# EAGLE design Base Station 2.4 (EAGLE 9.0.0)
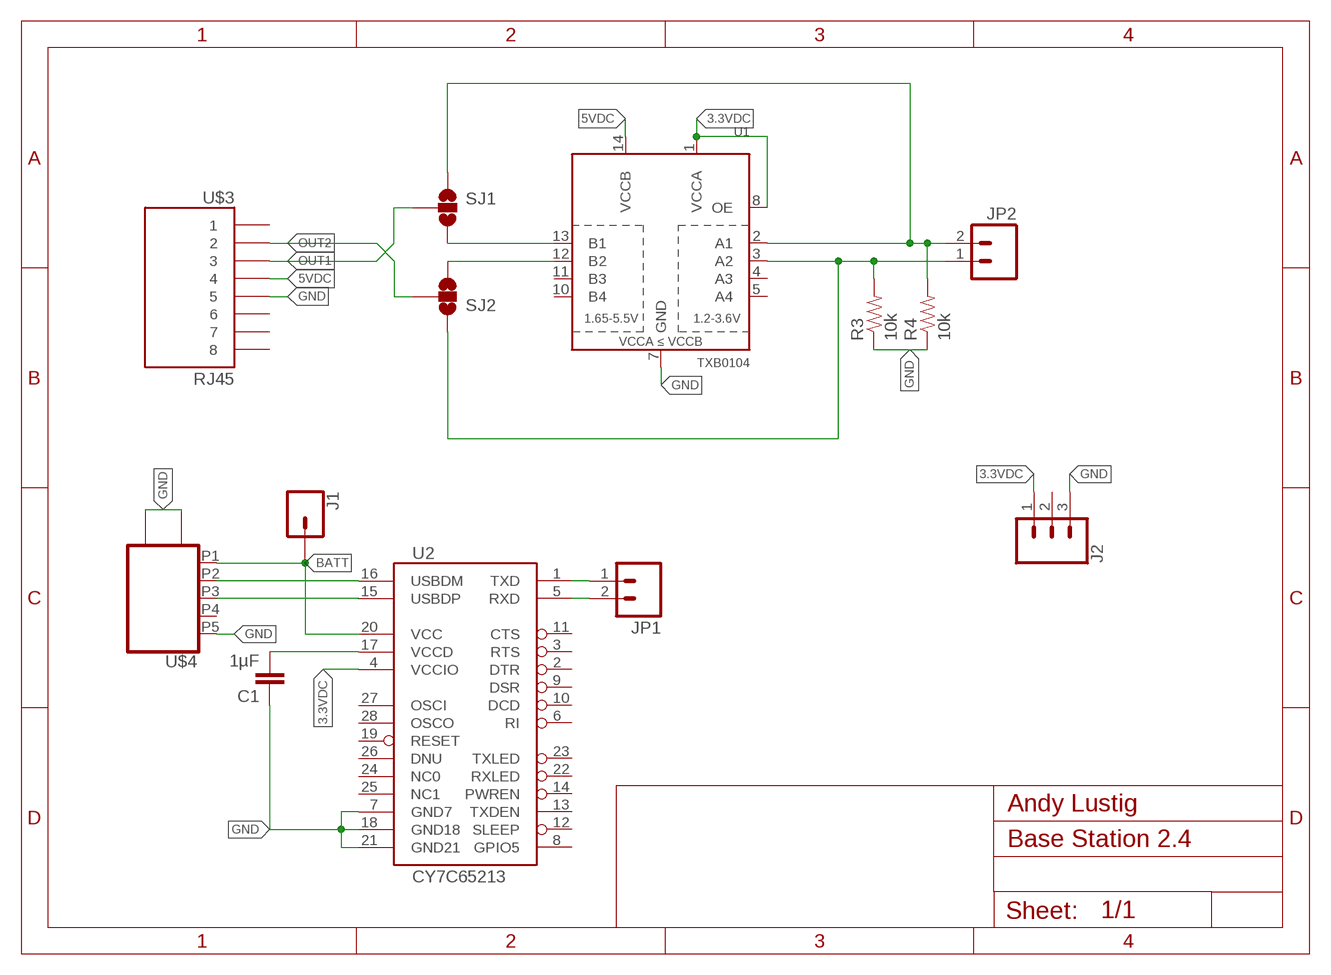
[diagram p0: schematic, sheet 1]

## Parts
C1  1µF  0.1UF-0603-25V-5%  [0603]
J1  CONN_01PTH_NO_SILK_YES_STOP  [1X01_NO_SILK]
J2  CONN_031X03_NO_SILK  [1X03_NO_SILK]
JP1  M021X02_NO_SILK  [1X02_NO_SILK]
JP2  M021X02_NO_SILK  [1X02_NO_SILK]
R3  10k  RESISTOR0805-RES  [0805]
R4  10k  RESISTOR0805-RES  [0805]
SJ1  SOLDERJUMPER_2WAYPASTE2&3  [SJ_3_PASTE2&3]
SJ2  SOLDERJUMPER_2WAYPASTE2&3  [SJ_3_PASTE2&3]
U1  TXB0104  TXB0104PWR  [TSSOP14]
U2  CY7C65213  [SSOP28DB]
U$3  RJ45  [RJ45-8]
U$4  USB_MICRO_SOCKET_HORZ_REINFORCED  [USB_HORZ_REINFORCED_MICRO]

## Nets
3.3VDC: J2.1 U1.1(VCCA) U1.8(OE) U2.4(VCCIO)
5VDC: U1.14(VCCB) U$3.4
BATT: J1.1 U2.20(VCC) U$4.P1
GND: C1.1 J2.3 R3.1 R4.1 U1.7(GND) U2.7(GND7) U2.18(GND18) U2.21(GND21) U$3.5 U$4.G1 U$4.G2 U$4.P5 U$4.P$1 U$4.P$2
N$1: JP1.1 U2.1(TXD)
N$2: JP1.2 U2.5(RXD)
N$3: U2.15(USBDP) U$4.P3
N$4: U2.16(USBDM) U$4.P2
N$5: C1.2 U2.17(VCCD)
N$6: JP2.2 R4.2 SJ1.1 U1.2(A1)
N$7: JP2.1 R3.2 SJ2.1 U1.3(A2)
N$8: SJ2.3 U1.12(B2)
N$9: SJ1.3 U1.13(B1)
OUT1: SJ1.2 U$3.3
OUT2: SJ2.2 U$3.2
Unconnected: J2.2 U1.4(A3) U1.5(A4) U1.10(B4) U1.11(B3) U2.2(DTR) U2.3(RTS) U2.6(RI) U2.8(GPIO5) U2.9(DSR) U2.10(DCD) U2.11(CTS) U2.12(SLEEP) U2.13(TXDEN) U2.14(PWREN) U2.19(RESET) U2.22(RXLED) U2.23(TXLED) U2.24(NC0) U2.26(DNU) U2.27(OSCI) U2.28(OSCO) U$3.1 U$3.6 U$3.7 U$3.8 U$4.P4

## Power pins joined to a net without a drawn wire
NC1: U2.25(NC1)

## Library data of the parts
C1 = SparkFun-Capacitors:0.1UF: 0.1µF ceramic capacitors A capacitor is a passive two-terminal electrical component used to store electrical energy temporarily in an electric field.; PROD_ID: CAP-08604; VALUE: 0.1uF
J1 = SparkFun-Connectors:CONN_01: Single connection point. Often used as Generic Header-pin footprint for 0.1 inch spaced/style header connections On any of the 0.1 inch spaced packages, you can populate with these: Break Away Headers - Straight <https://www.sparkfun.com/products/116> (PRT-00116) Break Away Male Headers - Right Angle <https://www.sparkfun.com/products/553> (PRT-00553) Female Headers <https://www.sparkfun.com/products/115> (PRT-00115) Break Away Headers - Machine Pin <https://www.sparkfun.com/products/117> (PRT-00117) Break Away Female Headers - Swiss Machine Pin <https://www.sparkfun.com/products/743> (PRT-00743) This device is also useful as a general connection point to wire up your design to another part of your project. Our various solder wires solder well into these plated through hole pads. Hook-Up Wire - Assortment (Stranded, 22 AWG) <https://www.sparkfun.com/products/11375> (PRT-11375) Hook-Up Wire - Assortment (Solid Core, 22 AWG) <https://www.sparkfun.com/products/11367> (PRT-11367) View the entire wire category on our website here <https://www.sparkfun.com/categories/141> Special notes: SMTSO-256-ET is a "flush mount" nut for a 4-40 screw. We mostly use this on specialty testbeds; it is a nice way to connect hardware to your PCB at an adjustable hieght. Also note, the SNAP packages are for using a snappable style connector. We sell a baggie of snaps and they are also used on two LilyPad designs: Snap Assortment - 30 pack (male and female) <https://www.sparkfun.com/products/11347> (DEV-11347) LilyPad Arduino SimpleSnap <https://www.sparkfun.com/products/10941> (DEV-10941) LilyPad SimpleSnap Protoboard <https://www.sparkfun.com/products/10940> (DEV-10940)
J2 = SparkFun-Connectors:CONN_03: Multi connection point. Often used as Generic Header-pin footprint for 0.1 inch spaced/style header connections On any of the 0.1 inch spaced packages, you can populate with these: Break Away Headers - Straight <https://www.sparkfun.com/products/116> (PRT-00116) Break Away Male Headers - Right Angle <https://www.sparkfun.com/products/553> (PRT-00553) Female Headers <https://www.sparkfun.com/products/115> (PRT-00115) Break Away Headers - Machine Pin <https://www.sparkfun.com/products/117> (PRT-00117) Break Away Female Headers - Swiss Machine Pin <https://www.sparkfun.com/products/743> (PRT-00743) Stackable Header - 3 Pin (Female, 0.1") <https://www.sparkfun.com/products/13875> (PRT-13875) For SCREWTERMINALS and SPRING TERMINALS visit here: Screw Terimnals on SparkFun.com <https://www.sparkfun.com/search/results?term=Screw+Terminals> (5mm/3.5mm/2.54mm spacing) This device is also useful as a general connection point to wire up your design to another part of your project. Our various solder wires solder well into these plated through hole pads. Hook-Up Wire - Assortment (Stranded, 22 AWG) <https://www.sparkfun.com/products/11375> (PRT-11375) Hook-Up Wire - Assortment (Solid Core, 22 AWG) <https://www.sparkfun.com/products/11367> (PRT-11367) View the entire wire category on our website here <https://www.sparkfun.com/categories/141> Special notes: Molex polarized connector foot print use with SKU : PRT-08232 with associated crimp pins and housings.
JP1 JP2 = SparkFun-Connectors:M02: Standard 2-pin 0.1" header. Use with - straight break away headers ( PRT-00116) - right angle break away headers (PRT-00553) - swiss pins (PRT-00743) - machine pins (PRT-00117) - female headers (PRT-00115) Molex polarized connector foot print use with: PRT-08233 with associated crimp pins and housings. 2.54_SCREWTERM for use with PRT-10571. 3.5mm Screw Terminal footprints for PRT-08084 5mm Screw Terminal footprints for use with PRT-08432
R3 R4 = Andy-library:RESISTOR: Resistor Basic schematic elements and footprints for 0603, 1206, and PTH resistors.
SJ1 SJ2 = SparkFun-Retired:SOLDERJUMPER_2WAY: Solder Jumper 2 way solder jumper
U1 = SparkFun-IC-Comms:TXB0104PWR: 4-Bit Bi-Directional Level Shifter 1.2V-3.6V (VCCA) to 1.65V-5.5V (VCCB) bi-directional level shifter with auto direction sensing. Max data rate - VCCA 1.8V: 20Mbps (50ns), VCCA 3.3V: 100Mbps (10ns) Digikey: 296-21929-1-ND (TSSOP) Datasheet <http://cdn.sparkfun.com/datasheets/BreakoutBoards/txb0104.pdf> SparkFun Products SparkFun Cellular Shield - MG2639 <https://www.sparkfun.com/products/13120> (CEL-13120) SparkFun Level Shifting microSD Breakout <https://www.sparkfun.com/products/13743> (DEV-13743) SparkFun Voltage-Level Translator Breakout - TXB0104 <https://www.sparkfun.com/products/11771> (BOB-11771) SparkFun Block for Intel® Edison - UART <https://www.sparkfun.com/products/13040> (DEV-13040) SparkFun Block for Intel® Edison - Arduino <https://www.sparkfun.com/products/13036> (DEV-13036); PROD_ID: NA-XXXXX
U2 = SparkFun-IC-Microcontroller:CY7C65213: CY7C65213 USB-UART controller USB UART SparkFun Products None; PROD_ID: IC-12487
U$3 = Andy-library:RJ45
U$4 = Andy-library:USB_MICRO_SOCKET: horizontal socket. Digikey 609-4616-1-ND

## Board
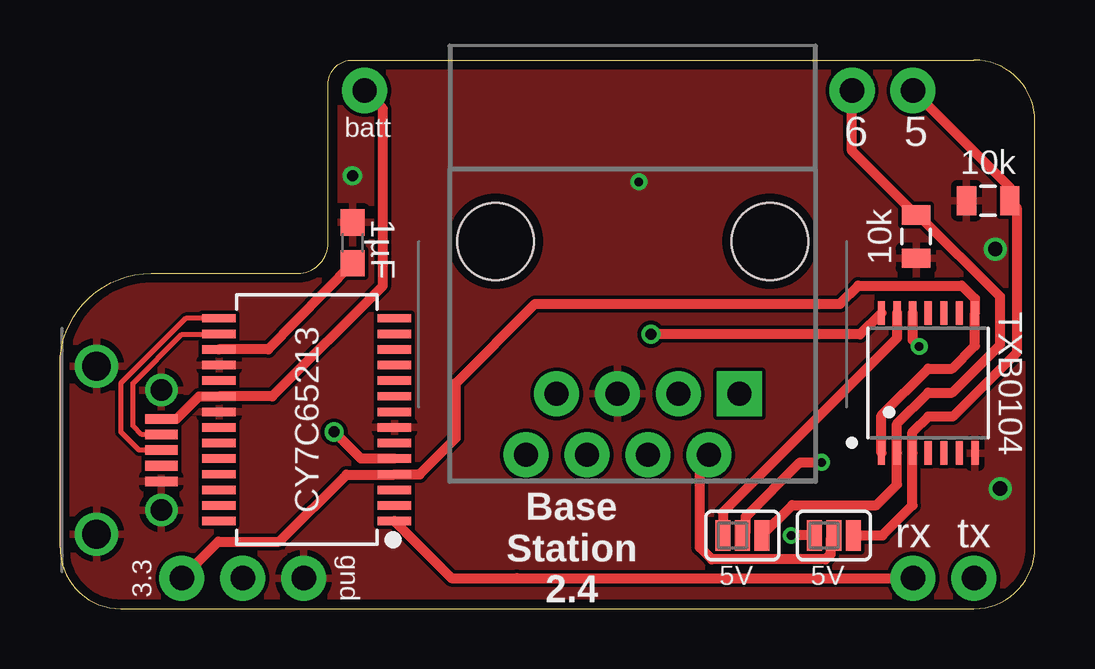
[diagram p1: board, top side]
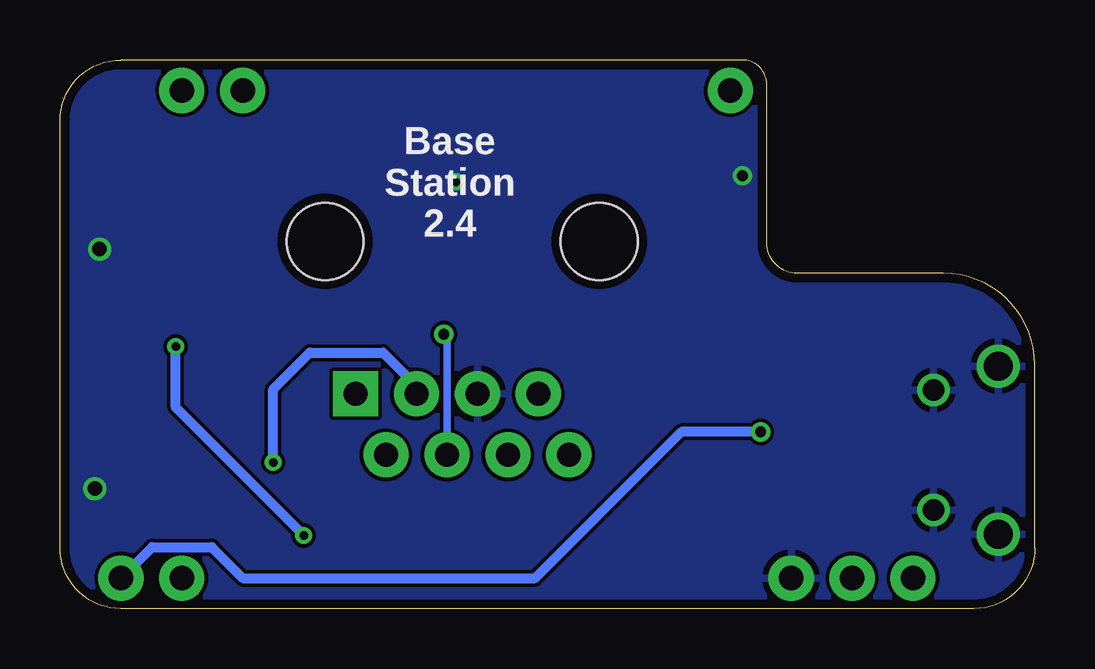
[diagram p2: board, bottom side, seen from below]

Size 40.64 x 22.86 mm. Coordinates in mm from the lower left corner, seen from the top.
Outline: 2.54,0 38.1,0 arc90 40.64,2.54 40.64,20.32 arc90 38.1,22.86 12.19,22.86 arc90 11.18,21.84 11.18,15.24 arc-90 9.91,13.97 3.81,13.97 arc90 0,10.16 0,2.54 arc90 2.54,0
Copper layers (1*16): Top 0.0356mm / dielectric 1.5011mm / Bottom 0.0356mm
Design rules "LaenPCBOrder *": minimum track width 6mil, minimum drill 13mil, track to track 6mil, track to pad 6mil, pad to pad 6mil, via to via 6mil, smd to smd 6mil, copper to edge 15mil, drill to drill 6mil, minimum pad ring 7mil, minimum via ring 7mil, stop-mask expansion 3mil, vias tented up to drill 25mil, thermal gap 10mil

### Footprints (pad centres in the part's own frame; a part is rotated, then mirrored left to right if it is on the bottom)
0603 = smd 1.1 x 1: 1 -0.85,0; 2 0.85,0
1X01_NO_SILK = drill 1.016 pad 1.88: 1 0,0
1X03_NO_SILK = drill 1.016 pad 1.88: 1 0,0; 2 2.54,0; 3 5.08,0
1X02_NO_SILK = drill 1.016 pad 1.88: 1 0,0; 2 2.54,0
0805 = smd 0.8 x 1.2: 1 -0.9,0; 2 0.9,0
SJ_3_PASTE2&3 = smd 0.635 x 1.27: 1 -0.813,0; 2 0,0; 3 0.813,0
TSSOP14 = smd 0.305 x 0.991: 1 -1.95,-2.918; 2 -1.3,-2.918; 3 -0.65,-2.918; 4 0,-2.918; 5 0.65,-2.918; 6 1.3,-2.918; 7 1.95,-2.918; 8 1.95,2.918; 9 1.3,2.918; 10 0.65,2.918; 11 0,2.918; 12 -0.65,2.918; 13 -1.3,2.918; 14 -1.95,2.918
SSOP28DB = smd 0.348 x 1.397: 1 -4.225,-3.656; 2 -3.575,-3.656; 3 -2.925,-3.656; 4 -2.275,-3.656; 5 -1.625,-3.656; 6 -0.975,-3.656; 7 -0.325,-3.656; 8 0.325,-3.656; 9 0.975,-3.656; 10 1.625,-3.656; 11 2.275,-3.656; 12 2.925,-3.656; 13 3.575,-3.656; 14 4.225,-3.656; 15 4.225,3.656; 16 3.575,3.656; 17 2.925,3.656; 18 2.275,3.656; 19 1.625,3.656; 20 0.975,3.656; 21 0.325,3.656; 22 -0.325,3.656; 23 -0.975,3.656; 24 -1.625,3.656; 25 -2.275,3.656; 26 -2.925,3.656; 27 -3.575,3.656; 28 -4.225,3.656
RJ45-8 = drill 1 pad 1.88 square: 1 -4.445,6.35 | drill 1 pad 1.88: 2 -3.175,8.89; 3 -1.905,6.35; 4 -0.635,8.89; 5 0.635,6.35; 6 1.905,8.89; 7 3.175,6.35; 8 4.445,8.89 | hole 3.2: -5.715,0; 5.715,0
USB_HORZ_REINFORCED_MICRO = drill 1.2: G1 -3.5,0; G2 3.5,0 | smd 0.4 x 1.35: P1 -1.3,2.7; P2 -0.65,2.7; P3 0,2.7; P4 0.65,2.7; P5 1.3,2.7 | drill 0.9: P$1 -2.5,2.7; P$2 2.5,2.7

### Placement (x,y rotation side)
C1  12.19,15.24 270 top
J1  12.7,21.59 0 top
J2  5.08,1.27 0 top
JP1  35.56,1.27 0 top
JP2  35.56,21.59 180 top
R3  38.69,17 0 top
R4  35.69,15.5 90 top
SJ1  28.45,3.05 180 top
SJ2  32.26,3.05 180 top
U1  36.19,9.4 0 top
U2  10.29,7.87 90 top
U$3  23.88,15.3 180 top
U$4  1.52,6.6 270 top

### Tracks (layer width: path | path; a pad name or v marks a point on that pad's centre or on a via)
3.3VDC
  Top 0.406: U1.1 34.24,8.05 36.19,10 37.19,10 38.14,10.95 U1.8 38.14,12.91 37.59,13.46 33.27,13.46 32.51,12.7 19.81,12.7 16.51,9.4 16.51,7.11 15,5.6 U2.4 13.93,5.59 11.94,5.59 9.14,2.79 6.6,2.79 J2.1
5VDC  (via drill 0.45)
  Top 0.406: U1.14 33.35,11.43 v24.64,11.43
  Bottom 0.305: v24.64,11.43 24.51,11.3 U$3.4
BATT
  Top 0.406: U$4.P1 4.86,7.9 5.8,8.85 U2.20 8.85,8.85 13.46,13.46 13.46,20.83 J1.1
GND  (via drill 0.35, 0.45, 0.6)
  other vias: 38.99,14.98 39.19,5 12.19,18.03 24.13,17.78
  pour Bottom: -1.27,24.13 43.18,24.13 43.18,-1.27 -1.27,-1.27
  pour Top: -1.27,24.13 43.18,24.13 43.18,-1.27 -1.27,-1.27
N$1
  Top 0.406: U2.1 16.32,1.27 19.05,1.27 JP1.1
N$2  (via drill 0.45)
  Top 0.406: U2.5 12.55,6.25 v11.43,7.37
  Bottom 0.406: JP1.2 36.8,2.56 34.31,2.56 33.02,1.27 20.83,1.27 14.73,7.37 v11.43,7.37
N$3
  Top 0.203: U$4.P3 3.3,6.6 2.54,7.37 2.54,9.4 5.24,12.1 U2.15
N$4
  Top 0.203: U2.16 6.61,11.43 5.08,11.43 3.05,9.4 3.05,7.62 3.41,7.25 U$4.P2
N$5
  Top 0.406: C1.2 8.68,10.8 U2.17
N$6
  Top 0.406: JP2.2 33.02,19.07 R4.2 35.79,16.4 39.19,13 39.19,11 37.19,9 36.19,9 34.89,7.7 U1.2 34.89,5.17 34.04,4.32 30.53,4.32 SJ1.1
N$7
  Top 0.406: JP2.1 39.59,17.56 R3.2 39.88,16.71 39.88,10.67 37.21,8 36.19,8 35.54,7.35 U1.3 35.54,4.3 34.29,3.05 SJ2.1
N$8  (via drill 0.35)
  Top 0.406: SJ2.3 v30.48,3.05 | U1.12 35.54,11.2 v35.81,10.92
  Bottom 0.406: v30.48,3.05 35.81,8.38 v35.81,10.92
N$9
  Top 0.406: SJ1.3 27.64,4.01 34.89,11.27 U1.13
OUT1  (via drill 0.35)
  Top 0.406: SJ1.2 28.59,3.19 28.59,3.83 30.85,6.1 v31.75,6.1
  Bottom 0.406: v31.75,6.1 31.75,9.14 30.23,10.67 27.18,10.67 25.78,9.27 U$3.3
OUT2
  Top 0.406: SJ2.2 32.12,2.91 32.12,2.27 31.91,2.06 27.17,2.06 26.69,2.54 26.67,2.54 26.67,6.03 U$3.2

### Text on the board
tPlace: batt | 6 | 5 | 3.3 | gnd
tNames: Base / Station / 2.4 | rx | tx | 5V | 5V
bNames: Base / Station / 2.4